# Altium schematic sheet op amp.SchDoc
size A
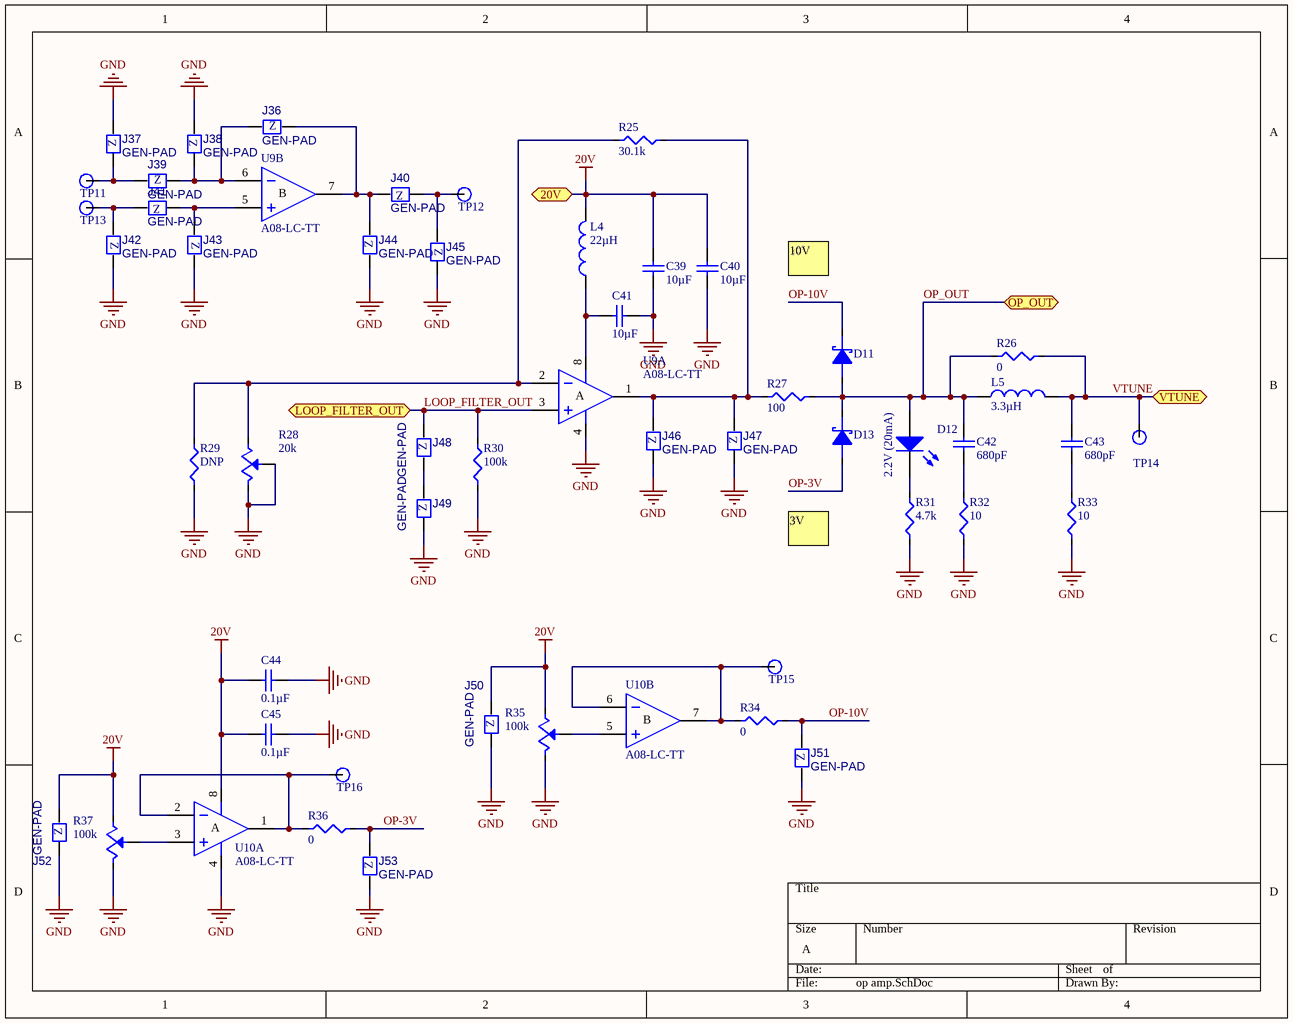
[diagram p0: op amp.SchDoc]

## Parts
C39  10µF  [C1210-2.5mm]
C40  10µF  [C1210-2.5mm]
C41  10µF  [C1210-2.5mm]
C42  680pF  [C0805-1.25MM]
C43  680pF  [C0805-1.25MM]
C44  0.1µF  [C0805-1.25MM]
C45  0.1µF  [C0805-1.25MM]
D11  SCHOTTKY  [SOD-123f]  (value not drawn)
D12  2.2V (20mA)  [0805-LED]
D13  SCHOTTKY  [SOD-123f]  (value not drawn)
J36  GEN-PAD  [0805-DNP]
J37  GEN-PAD  [0805-DNP]
J38  GEN-PAD  [0805-DNP]
J39  GEN-PAD  [0805-DNP]
J40  GEN-PAD  [0805-DNP]
J41  GEN-PAD  [0805-DNP]
J42  GEN-PAD  [0805-DNP]
J43  GEN-PAD  [0805-DNP]
J44  GEN-PAD  [0805-DNP]
J45  GEN-PAD  [0805-DNP]
J46  GEN-PAD  [0805-DNP]
J47  GEN-PAD  [0805-DNP]
J48  GEN-PAD  [0805-DNP]
J49  GEN-PAD  [0805-DNP]
J50  GEN-PAD  [0805-DNP]
J51  GEN-PAD  [0805-DNP]
J52  GEN-PAD  [0805-DNP]
J53  GEN-PAD  [0805-DNP]
L4  value 22µH  [L1210]  (hidden comment: L)
L5  value 3.3µH  [L1210]  (hidden comment: L)
R25  30.1k  [0805-0.45MM]
R26  0  [0805-0.45MM]
R27  100  [0805-0.45MM]
R28  20k  [3310Y]
R29  DNP  [0805-DNP]
R30  100k  [0805-0.45MM]
R31  4.7k  [0805-0.45MM]
R32  10  [0805-0.45MM]
R33  10  [0805-0.45MM]
R34  0  [0805-0.45MM]
R35  100k  [3310Y]
R36  0  [0805-0.45MM]
R37  100k  [3310Y]
TP11  TP-LOOP  [TP-LOOP]  (value not drawn)
TP12  TP-LOOP  [TP-LOOP]  (value not drawn)
TP13  TP-LOOP  [TP-LOOP]  (value not drawn)
TP14  TP-LOOP  [TP-LOOP]  (value not drawn)
TP15  TP-LOOP  [TP-LOOP]  (value not drawn)
TP16  TP-LOOP  [TP-LOOP]  (value not drawn)
U9  A08-LC-TT  [PDIP-8-(7.62mm)-SOCKET]  (parts A,B of 2)
U10  A08-LC-TT  [PDIP-8-(7.62mm)-SOCKET]  (parts A,B of 2)

## Ports
20V, LOOP_FILTER_OUT, OP_OUT, VTUNE

## Nets
20V: C39.2 C40.2 C44.1 C45.1 J50.1 J52.1 L4.2 R35.1 R37.1 U10.8(V+) ; port 20V
GND: C39.1 C40.1 C41.2 C44.2 C45.2 J37.1 J38.1 J42.1 J43.1 J44.2 J45.1 J46.2 J47.2 J49.2 J50.2 J51.2 J52.2 J53.2 R28.2 R28.3 R29.1 R30.1 R31.1 R32.1 R33.1 R35.3 R37.3 U9.4(V-) U10.4(V-)
LOOP_FILTER_OUT: J48.1 R30.2 U9.3(IN+) ; port LOOP_FILTER_OUT
OP-3V: D13.A J53.1 R36.2
OP-10V: D11.C J51.1 R34.2
OP_OUT: C42.2 D11.A D12.A D13.C L5.1 R26.1 R27.2 ; port OP_OUT
VTUNE: C43.2 L5.2 R26.2 TP14.0 ; port VTUNE
NetC41_1: C41.1 L4.1 U9.8(V+)
NetC42_1: C42.1 R32.2
NetC43_1: C43.1 R33.2
NetD12_C: D12.C R31.2
NetJ36_1: J36.1 J40.1 J44.1 U9.7
NetJ36_2: J36.2 J38.2 J39.1 U9.6(IN-)
NetJ37_2: J37.2 J39.2 TP11.0
NetJ40_2: J40.2 J45.2 TP12.0
NetJ41_1: J41.1 J42.2 TP13.0
NetJ41_2: J41.2 J43.2 U9.5(IN+)
NetJ46_1: J46.1 J47.1 R25.2 R27.1 U9.1(OUT)
NetJ48_2: J48.2 J49.1
NetR25_1: R25.1 R28.1 R29.2 U9.2(IN-)
NetR34_1: R34.1 TP15.0 U10.6(IN-) U10.7
NetR35_2: R35.2 U10.5(IN+)
NetR36_1: R36.1 TP16.0 U10.1(OUT) U10.2(IN-)
NetR37_2: R37.2 U10.3(IN+)

## Notes on the sheet
- 10V
- 3V
- (in symbol EE-GEN-00001) Z
- (in symbol EE-OPAMP-00002, part A) A
- (in symbol EE-OPAMP-00002, part B) B
- (in symbol PDIP-8-(7.62mm)-SOCKET, part A) A
- (in symbol PDIP-8-(7.62mm)-SOCKET, part B) B

## Library data of the parts
C39-C41 = EE-CAP-00013: Capacitor; Part Description: CAP CER 10UF 50V 10% X5R 1210; Manufacturer: Taiyo; Manufacturer Part Number: UMK325BJ106KM-T; Record Number: 13; Voltage: 50V; PackageDescription: Chip Capacitor; EE Part Number: EE-CAP-00013; Value: 10µF; Datasheet Link: UMK325BJ106KM-T; Supplier 1: DigiKey; Supplier Part Number 1: 587-2247-1-ND; Supplier Link 1: DigiKey
C42 C43 = EE-CAP-00012: Capacitor; Part Description: CAP CER 680PF 50V 1% NP0 0805; Manufacturer: Kemet; Manufacturer Part Number: C0805C681F5GACTU; Record Number: 12; Voltage: 50V; PackageDescription: Chip Capacitor; EE Part Number: EE-CAP-00012; Value: 680pF; Datasheet Link: C0805C681F5GACTU; Supplier 1: DigiKey; Supplier Part Number 1: 399-8110-1-ND; Supplier Link 1: DigiKey
C44 C45 = EE-CAP-00014: Capacitor; Part Description: CAP CER 0.1UF 50V 10% X7R 0805; Manufacturer: Kemet; Manufacturer Part Number: C0805C104K5RACTU; Record Number: 14; Voltage: 50V; PackageDescription: Chip Capacitor; EE Part Number: EE-CAP-00014; Value: 0.1µF; Datasheet Link: C0805C104K5RACTU; Supplier 1: DigiKey; Supplier Part Number 1: 399-1170-1-ND; Supplier Link 1: DigiKey
D11 D13 = EE-DIODE-00002: Schottky Diode; Part Description: DIODE SCHOTTKY 30V 1A SFLAT; Manufacturer: Toshiba; Manufacturer Part Number: CRS01(TE85L,Q,M); Record Number: 2; Value: 30V (1A); Voltage: 30V; Current: 1A; EE Part Number: EE-DIODE-00002; Datasheet Link: CRS01(TE85L,Q,M); Supplier 1: DigiKey; Supplier Part Number 1: CRS01QCT-ND; Supplier Link 1: DigiKey; Supplier 2: Mouser; Supplier Part Number 2: 757-CRS01(TE85L,Q,M); Supplier Link 2: Mouser
D12 = EE-DIODE-00003: LED; Part Description: LED CHIPLED 570NM GREEN 0805 SMD; Manufacturer: OSRAM; Manufacturer Part Number: LG R971-KN-1; Record Number: 3; Revision: July-2002: Re-released for DXP Platform.; EE Part Number: EE-DIODE-00003; Value: 2.2V (20mA); Voltage: 2.2V; Current: 20mA; Datasheet Link: LG R971-KN-1; Supplier 1: DigiKey; Supplier Part Number 1: 475-1410-1-ND; Supplier Link 1: DigiKey; Supplier 2: Mouser; Supplier Part Number 2: 720-LGR971-KN-1; Supplier Link 2: Mouser
J36-J53 = EE-GEN-00001: Generic Component; Part Description: 0805 Generic Comp; Record Number: 1; EE Part Number: EE-GEN-00001; Value: GEN-0805; Pins: 2; Manufacturer: N/A; Manufacturer Part Number: N/A; Supplier 1: N/A; Supplier Part Number 1: N/A
L4 = EE-L-00005: Inductor; Part Description: INDUCTOR 22UH 10% 1210 SMD; Manufacturer: Taiyo Yuden; Manufacturer Part Number: CBC3225T220KRV; Record Number: 5; Current: 780mA; Tolerance: ±10%; Resistance: 351 mOhm Max; EE Part Number: EE-L-00005; Datasheet Link: CBC3225T220KRV; Supplier 1: DigiKey; Supplier Part Number 1: 587-3704-1-ND; Supplier Link 1: DigiKey; Supplier 2: Mouser; Supplier Part Number 2: 963-CBC3225T220KRV; Supplier Link 2: Mouser
L5 = EE-L-00006: Inductor; Part Description: INDUCTOR POWER 3.3UH 1210; Manufacturer: TDK; Manufacturer Part Number: NLV32T-3R3J-PF; Record Number: 6; Current: 260mA; Tolerance: ±5%; Resistance: 1.2 Ohm Max; EE Part Number: EE-L-00006; Datasheet Link: NLV32T-3R3J-PF; Supplier 1: DigiKey; Supplier Part Number 1: 445-1520-1-ND; Supplier Link 1: DigiKey
R25 = EM-RES-01089: Part Description: RES 30.1K OHM 1/8W 1% 0805 SMD; Manufacturer: Vishay; Manufacturer Part Number: CRCW080530K1FKEA; Record Number: 1089; Tolerance: 1%; Power: 0.125W; EM Part Number: EM-RES-01089; Value: 30.1k; Supplier 1: Digi-Key; Supplier Part Number 1: 541-30.1KCCT-ND
R26 R34 R36 = EM-RES-01617: Part Description: RES 0.0 OHM .33W 0805 SMD; Manufacturer: Vishay; Manufacturer Part Number: CRCW08050000Z0EAHP; Record Number: 1617; Power: 0.33W; EM Part Number: EM-RES-01617; Value: 0; Tolerance: N/A; Datasheet Link: http://www.vishay.com/docs/20043/crcwhpe3.pdf; Supplier 1: Digi-Key; Supplier Part Number 1: 541-0.0TBCT-ND; Supplier Link 1: http://www.Digi-Key.com/product-detail/en/CRCW08050000Z0EAHP/541-0.0TBCT-ND/2222831
R27 = EM-RES-01370: Part Description: RES 100 OHM 1/8W 1% 0805 SMD; Manufacturer: Vishay; Manufacturer Part Number: CRCW0805100RFKEA; Record Number: 1370; Tolerance: 1%; Power: 0.125W; EM Part Number: EM-RES-01370; Value: 100; Supplier 1: Digi-Key; Supplier Part Number 1: 541-100CCT-ND
R28 = EE-POT-00002: POTENTIOMETER; Part Description: POT 20K OHM 9MM SQ PLASTIC; Manufacturer: Bourns; Manufacturer Part Number: 3310Y-001-203L; Record Number: 2; Tolerance: ±20%; Power: 0.25W, 1/4W; EE Part Number: EE-POT-00002; Value: 20k; Datasheet Link: 3310Y-001-203L; Supplier 1: DigiKey; Supplier Part Number 1: 3310Y-001-203L-ND; Supplier Link 1: DigiKey; Supplier 2: Mouser; Supplier Part Number 2: 652-3310Y-001-203L; Supplier Link 2: Mouser
R29 = EM-RES-01607: Part Description: DNP 0805 JUMPER; Record Number: 1607; EM Part Number: EM-RES-01607; Value: DNP; Tolerance: N/A; Power: N/A; Manufacturer: N/A; Manufacturer Part Number: N/A; Datasheet Link: N/A; Supplier 1: N/A; Supplier Part Number 1: N/A; Supplier Link 1: N/A
R30 = EM-RES-01028: Part Description: RES 100K OHM 1/8W 1% 0805 SMD; Manufacturer: Vishay; Manufacturer Part Number: CRCW0805100KFKEA; Record Number: 1028; Tolerance: 1%; Power: 0.125W; EM Part Number: EM-RES-01028; Value: 100k; Supplier 1: Digi-Key; Supplier Part Number 1: 541-100KCCT-ND
R31 = EM-RES-01180: Part Description: RES 4.70K OHM 1/8W 1% 0805 SMD; Manufacturer: Vishay; Manufacturer Part Number: CRCW08054K70FKEA; Record Number: 1180; Tolerance: 1%; Power: 0.125W; EM Part Number: EM-RES-01180; Value: 4.7k; Supplier 1: Digi-Key; Supplier Part Number 1: 541-4.70KCCT-ND
R32 R33 = EM-RES-01484: Part Description: RES 10.0 OHM 1/8W 1% 0805 SMD; Manufacturer: Vishay; Manufacturer Part Number: CRCW080510R0FKEA; Record Number: 1484; Tolerance: 1%; Power: 0.125W; EM Part Number: EM-RES-01484; Value: 10; Supplier 1: Digi-Key; Supplier Part Number 1: 541-10.0CCT-ND
R35 R37 = EE-POT-00003: POTENTIOMETER; Part Description: POT 100K OHM 9MM SQ PLASTIC; Manufacturer: Bourns; Manufacturer Part Number: 3310Y-001-104L; Record Number: 3; Tolerance: ±20%; Power: 0.25W, 1/4W; EE Part Number: EE-POT-00003; Value: 100k; Datasheet Link: 3310Y-001-104L; Supplier 1: DigiKey; Supplier Part Number 1: 3310Y-001-104L-ND; Supplier Link 1: DigiKey; Supplier 2: Mouser; Supplier Part Number 2: 652-3310Y-001-104L; Supplier Link 2: Mouser
TP11-TP16 = EM-TP-00006: Part Description: 0.040" Test Point; Record Number: 6; EM Part Number: EM-TP-00006; Value: TP-LOOP; Pins: 1; Manufacturer: N/A; Manufacturer Part Number: N/A; Supplier 1: N/A; Supplier Part Number 1: N/A
U9 = EE-OPAMP-00002: OP284; Part Description: DNP-Socket; Manufacturer: Assmann; Record Number: 2; EE Part Number: EE-OPAMP-00002; Value: A08-LC-TT; Voltage: N/A; Drive Current: N/A; Channels: 2; Package: PDIP-8; Manufacturer Part Number: A08-LC-TT; Datasheet Link: A08-LC-TT; Supplier 1: DigiKey; Supplier Part Number 1: AE9986-ND; Supplier Link 1: DigiKey
U10 = PDIP-8-(7.62mm)-SOCKET: OP284; EE Part Number: EE-OPAMP-00002; Part Description: DNP-Socket; Manufacturer: Assmann; Record Number: 2; Value: A08-LC-TT; Voltage: N/A; Drive Current: N/A; Channels: 2; Package: PDIP-8; Manufacturer Part Number: A08-LC-TT; Datasheet Link: A08-LC-TT; Supplier 1: DigiKey; Supplier Part Number 1: AE9986-ND; Supplier Link 1: DigiKey